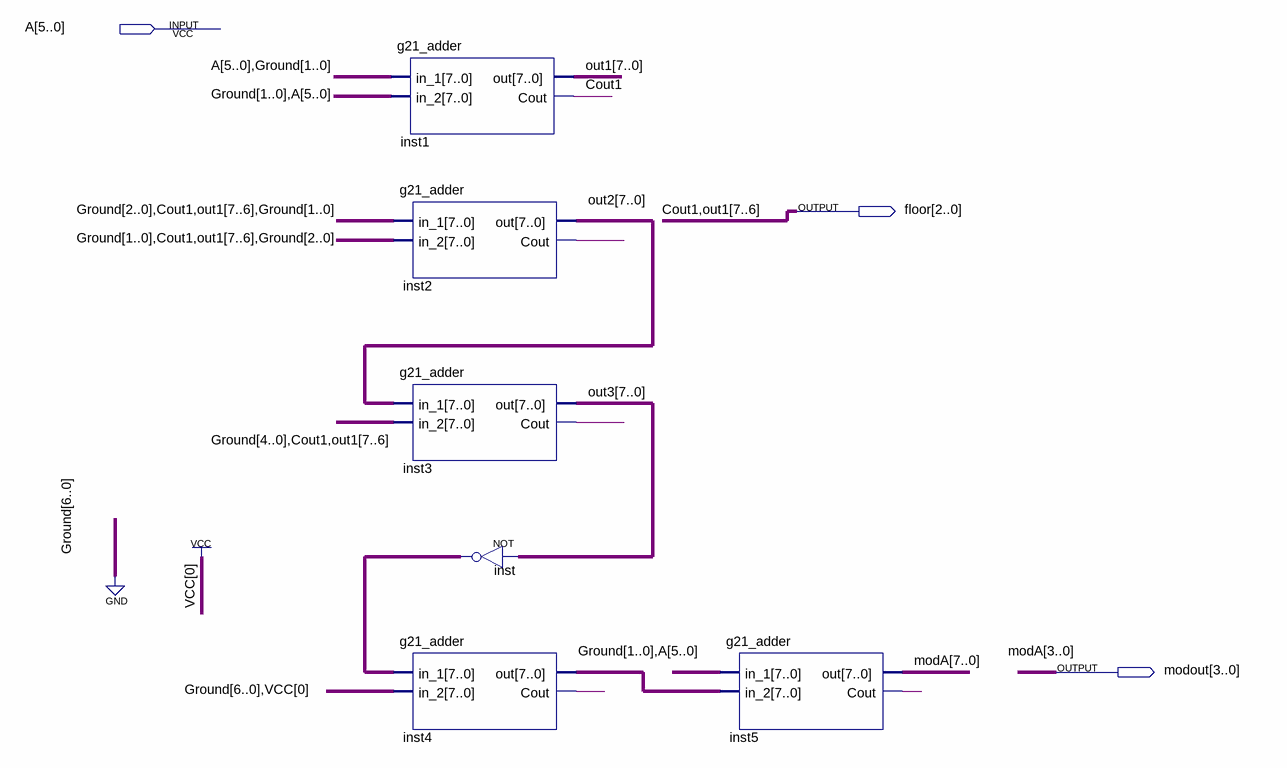
[diagram p0: schematic sheet]
// Quartus schematic g21_Modulo_13.bdf as structural Verilog: 6 symbols, 3 pins
module g21_Modulo_13 (
  input  [5:0] A,
  output [2:0] floor,
  output [3:0] modout
);

  wire inst2_cout, inst3_cout, inst4_cout, inst5_cout;
  wire [5:0] out1;
  wire [7:0] inst4_out, inst_out, out2, out3;
  wire [7:4] modA;

  g21_adder inst1 (.in_1({A, 2'b00}), .in_2({2'b00, A}), .out({floor[1:0], out1}), .Cout(floor[2]));
  g21_adder inst2 (.in_1({3'b000, floor, 2'b00}), .in_2({2'b00, floor, 3'b000}), .out(out2), .Cout(inst2_cout));
  g21_adder inst3 (.in_1(out2), .in_2({{5{1'b0}}, floor}), .out(out3), .Cout(inst3_cout));
  assign inst_out = ~out3;  // NOT inst, 8 bits wide
  g21_adder inst4 (.in_1(inst_out), .in_2(8'b00000001), .out(inst4_out), .Cout(inst4_cout));
  g21_adder inst5 (.in_1({2'b00, A}), .in_2(inst4_out), .out({modA, modout}), .Cout(inst5_cout));

  // Other names for the same wires on the sheet: out1[7:6] = floor[1:0]; Cout1 = floor[2]; modA[3:0] = modout
endmodule
